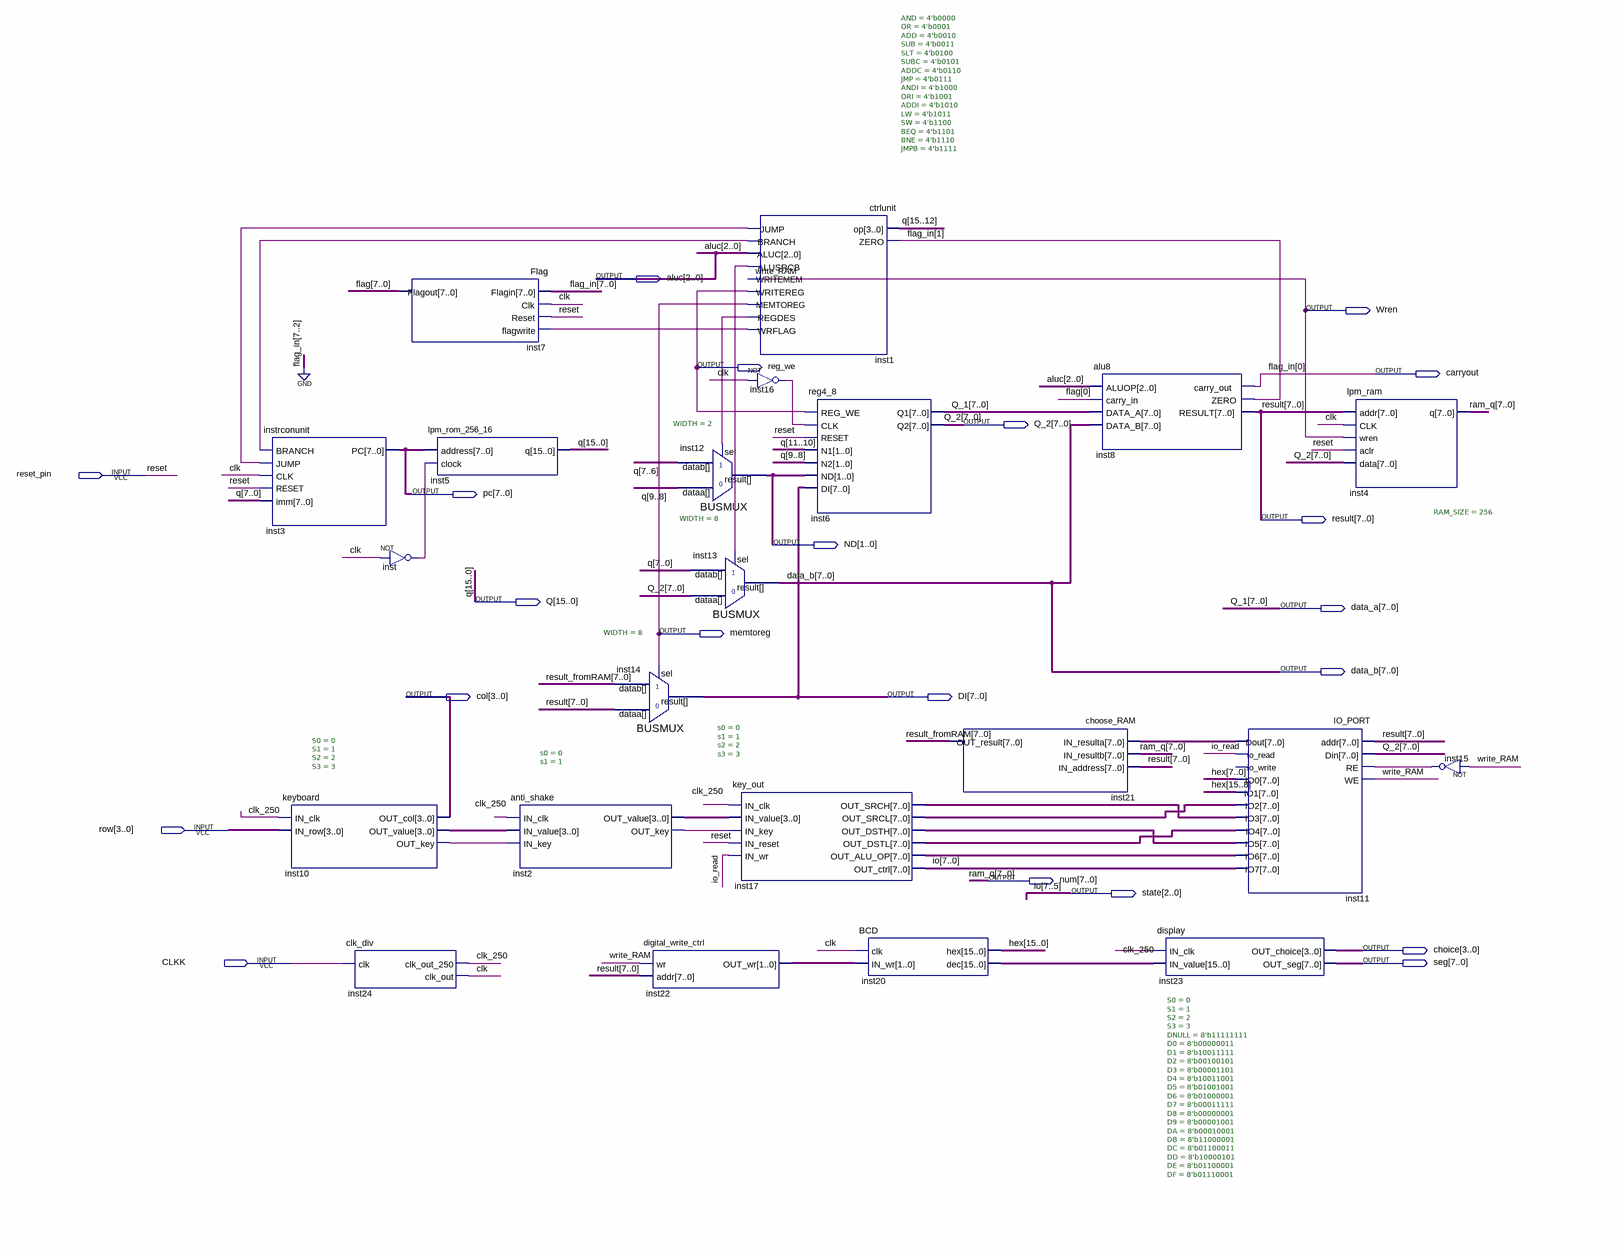
[diagram p0: schematic sheet]
// Quartus schematic test_computer.bdf as structural Verilog: 22 symbols, 21 pins
module test_computer (
  input  reset_pin,
  input  [3:0] row,
  input  CLKK,
  output [2:0] aluc,
  output Wren,
  output reg_we,
  output carryout,
  output [7:0] Q_2,
  output [7:0] pc,
  output [7:0] result,
  output [1:0] ND,
  output [15:0] Q,
  output [7:0] data_a,
  output memtoreg,
  output [7:0] data_b,
  output [3:0] col,
  output [7:0] DI,
  output [7:0] num,
  output [2:0] state,
  output [3:0] choice,
  output [7:0] seg
);

  wire clk, clk_250, inst1_alusrcb, inst1_branch, inst1_jump, inst1_regdes, inst1_wrflag, inst2_out_key,
       inst10_out_key, inst15_out, inst16_out, inst_out, io_read;
  wire [1:0] inst22_out_wr;
  wire [1:1] flag_in;
  wire [3:0] inst2_out_value, inst10_out_value;
  wire [4:0] io;
  wire [7:0] flag, inst11_dout, inst17_out_alu_op, inst17_out_dsth, inst17_out_dstl, inst17_out_srch,
       inst17_out_srcl, result_fromRAM;
  wire [15:0] hex, inst20_dec;

  instrconunit inst3 (.BRANCH(inst1_branch), .JUMP(inst1_jump), .CLK(clk), .RESET(reset_pin), .imm(Q[7:0]), .PC(pc));
  keyboard #(.S0(0), .S1(1), .S2(2), .S3(3)) inst10 (
    .IN_clk(clk_250), .IN_row(row), .OUT_col(col), .OUT_value(inst10_out_value), .OUT_key(inst10_out_key));
  clk_div inst24 (.clk(CLKK), .clk_out_250(clk_250), .clk_out(clk));
  Flag inst7 (
    .Flagin({{6{1'b0}}, flag_in[1], carryout}), .Clk(clk), .Reset(reset_pin), .flagwrite(inst1_wrflag),
    .Flagout(flag));
  lpm_rom_256_16 inst5 (.address(pc), .clock(inst_out), .q(Q));
  not inst (inst_out, clk);
  anti_shake #(.s0(0), .s1(1)) inst2 (
    .IN_clk(clk_250), .IN_value(inst10_out_value), .IN_key(inst10_out_key), .OUT_value(inst2_out_value),
    .OUT_key(inst2_out_key));
  BUSMUX #(.WIDTH(8)) inst14 (.datab(result_fromRAM), .sel(memtoreg), .dataa(result), .result(DI));
  BUSMUX #(.WIDTH(2)) inst12 (.datab(Q[7:6]), .sel(inst1_regdes), .dataa(Q[9:8]), .result(ND));
  digital_write_ctrl inst22 (.wr(Wren), .addr(result), .OUT_wr(inst22_out_wr));
  BUSMUX #(.WIDTH(8)) inst13 (.datab(Q[7:0]), .sel(inst1_alusrcb), .dataa(Q_2), .result(data_b));
  key_out #(.s0(0), .s1(1), .s2(2), .s3(3)) inst17 (
    .IN_clk(clk_250), .IN_value(inst2_out_value), .IN_key(inst2_out_key), .IN_reset(reset_pin),
    .IN_wr(io_read), .OUT_SRCH(inst17_out_srch), .OUT_SRCL(inst17_out_srcl), .OUT_DSTH(inst17_out_dsth),
    .OUT_DSTL(inst17_out_dstl), .OUT_ALU_OP(inst17_out_alu_op), .OUT_ctrl({state, io}));
  ctrlunit #(.AND(4'b0000), .OR(4'b0001), .ADD(4'b0010), .SUB(4'b0011), .SLT(4'b0100), .SUBC(4'b0101), .ADDC(4'b0110), .JMP(4'b0111), .ANDI(4'b1000), .ORI(4'b1001), .ADDI(4'b1010), .LW(4'b1011), .SW(4'b1100), .BEQ(4'b1101), .BNE(4'b1110), .JMPB(4'b1111)) inst1 (
    .op(Q[15:12]), .ZERO(flag_in[1]), .JUMP(inst1_jump), .BRANCH(inst1_branch), .ALUC(aluc),
    .ALUSRCB(inst1_alusrcb), .WRITEMEM(Wren), .WRITEREG(reg_we), .MEMTOREG(memtoreg), .REGDES(inst1_regdes),
    .WRFLAG(inst1_wrflag));
  not inst16 (inst16_out, clk);
  reg4_8 inst6 (
    .REG_WE(reg_we), .CLK(inst16_out), .RESET(reset_pin), .N1(Q[11:10]), .N2(Q[9:8]), .ND(ND), .DI(DI),
    .Q1(data_a), .Q2(Q_2));
  BCD inst20 (.clk(clk), .IN_wr(inst22_out_wr), .dec(inst20_dec), .hex(hex));
  choose_RAM inst21 (.IN_resulta(inst11_dout), .IN_resultb(num), .IN_address(result), .OUT_result(result_fromRAM));
  alu8 inst8 (
    .ALUOP(aluc), .carry_in(flag[0]), .DATA_A(data_a), .DATA_B(data_b), .carry_out(carryout),
    .ZERO(flag_in[1]), .RESULT(result));
  display #(.S0(0), .S1(1), .S2(2), .S3(3), .DNULL(8'b11111111), .D0(8'b00000011), .D1(8'b10011111), .D2(8'b00100101), .D3(8'b00001101), .D4(8'b10011001), .D5(8'b01001001), .D6(8'b01000001), .D7(8'b00011111), .D8(8'b00000001), .D9(8'b00001001), .DA(8'b00010001), .DB(8'b11000001), .DC(8'b01100011), .DD(8'b10000101), .DE(8'b01100001), .DF(8'b01110001)) inst23 (
    .IN_clk(clk_250), .IN_value(inst20_dec), .OUT_choice(choice), .OUT_seg(seg));
  IO_PORT inst11 (
    .addr(result), .Din(Q_2), .RE(inst15_out), .WE(Wren), .Dout(inst11_dout), .io_read(io_read),
    .IO0(hex[7:0]), .IO1(hex[15:8]), .IO2(inst17_out_srcl), .IO3(inst17_out_srch), .IO4(inst17_out_dstl),
    .IO5(inst17_out_dsth), .IO6(inst17_out_alu_op), .IO7({state, io}));  // open: io_write
  lpm_ram #(.RAM_SIZE(256)) inst4 (.addr(result), .CLK(clk), .wren(Wren), .aclr(reset_pin), .data(Q_2), .q(num));
  not inst15 (inst15_out, Wren);

  // Other names for the same wires on the sheet: flag_in[0] = carryout; io[7:5] = state; Q_1[7:0] = data_a;
  //   ram_q[7:0] = num; reset = reset_pin; write_RAM = Wren
endmodule
